# EAGLE design nano_v1.1 (EAGLE 6.3)
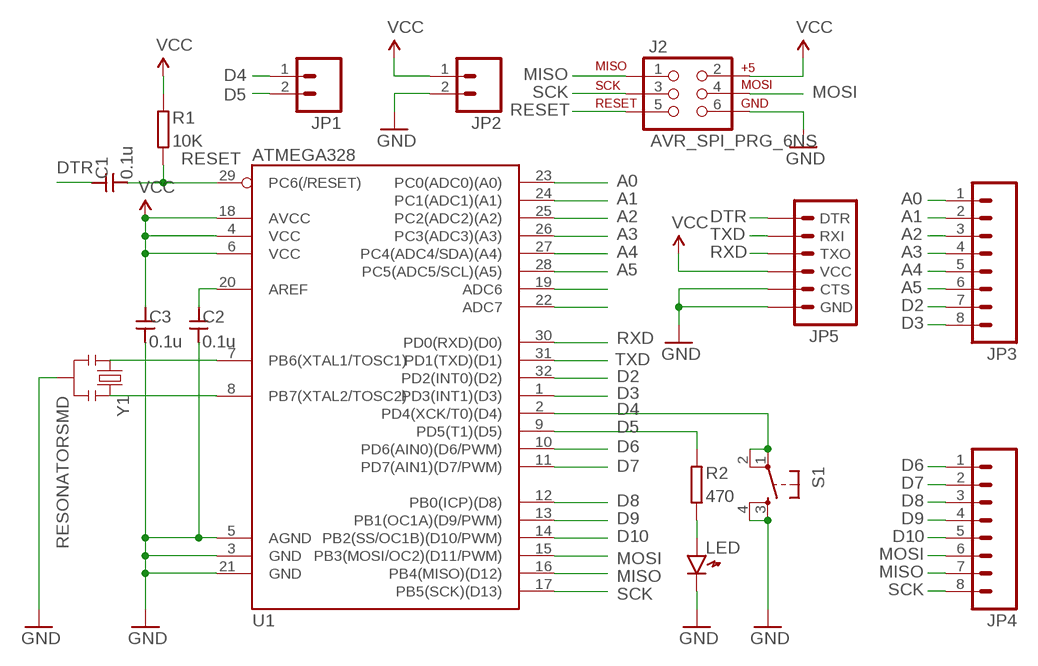
[diagram p0: schematic, sheet 1]

## Parts
C1  0.1u  CAPACITOR1608  [SMD1608]
C2  0.1u  CAPACITOR1608  [SMD1608]
C3  0.1u  CAPACITOR1608  [SMD1608]
J2  AVR_SPI_PRG_6NS  [2X3-NS]
JP1  M02PTH  [1X02]
JP2  M02PTH  [1X02]
JP3  M081X08  [1X08]
JP4  M081X08  [1X08]
JP5  ARDUINO_SERIAL_PROGRAMPTH  [1X06]
LED  LED1608  [LED1608]
R1  10K  REGISTOR1608  [SMD1608]
R2  470  REGISTOR1608  [SMD1608]
S1  TAC_SWITCHSMD  [TACTILE_SWITCH_SMD]
U1  ATMEGA328  [TQFP32-08]
Y1  RESONATORSMD  [RESONATOR-SMD]

## Nets
A0: JP3.1 U1.23(PC0(ADC0)(A0))
A1: JP3.2 U1.24(PC1(ADC1)(A1))
A2: JP3.3 U1.25(PC2(ADC2)(A2))
A3: JP3.4 U1.26(PC3(ADC3)(A3))
A4: JP3.5 U1.27(PC4(ADC4/SDA)(A4))
A5: JP3.6 U1.28(PC5(ADC5/SCL)(A5))
D2: JP3.7 U1.32(PD2(INT0)(D2))
D3: JP3.8 U1.1(PD3(INT1)(D3))
D4: JP1.1 S1.1 S1.2 U1.2(PD4(XCK/T0)(D4))
D5: JP1.2 R2.1 U1.9(PD5(T1)(D5))
D6: JP4.1 U1.10(PD6(AIN0)(D6/PWM))
D7: JP4.2 U1.11(PD7(AIN1)(D7/PWM))
D8: JP4.3 U1.12(PB0(ICP)(D8))
D9: JP4.4 U1.13(PB1(OC1A)(D9/PWM))
D10: JP4.5 U1.14(PB2(SS/OC1B)(D10/PWM))
DTR: C1.1 JP5.1(DTR)
GND: C2.2 C3.2 J2.6 JP2.2 JP5.5(CTS) JP5.6(GND) LED.K S1.3 S1.4 U1.3(GND) U1.5(AGND) U1.21(GND) Y1.2
MISO: J2.1 JP4.7 U1.16(PB4(MISO)(D12))
MOSI: J2.4 JP4.6 U1.15(PB3(MOSI/OC2)(D11/PWM))
N$1: LED.A R2.2
N$10: C2.1 U1.20(AREF)
N$12: U1.8(PB7(XTAL2/TOSC2)) Y1.3
N$13: U1.7(PB6(XTAL1/TOSC1)) Y1.1
N$20: U1.19(ADC6)
N$21: U1.22(ADC7)
RESET: C1.2 J2.5 R1.2 U1.29(PC6(/RESET))
RXD: JP5.3(TXO) U1.30(PD0(RXD)(D0))
SCK: J2.3 JP4.8 U1.17(PB5(SCK)(D13))
TXD: JP5.2(RXI) U1.31(PD1(TXD)(D1))
VCC: C3.1 J2.2 JP2.1 JP5.4(VCC) R1.1 U1.4(VCC) U1.6(VCC) U1.18(AVCC)

## Library data of the parts
C1-C3 = kawaiti:CAPACITOR: Generic Capacitor
J2 = SparkFun-Connectors:AVR_SPI_PRG_6: AVR ISP 6 Pin This is the reduced ISP connector for AVR programming. Common on Arduino. This footprint will take up less PCB space and can be used with a 10-pin to 6-pin adapter such as SKU: BOB-08508
JP1 JP2 = SparkFun-Connectors:M02: Header 2 Standard 2-pin 0.1" header. Use with straight break away headers (SKU : PRT-00116), right angle break away headers (PRT-00553), swiss pins (PRT-00743), machine pins (PRT-00117), and female headers (PRT-00115). Molex polarized connector foot print use with SKU : PRT-08233 with associated crimp pins and housings.
JP3 JP4 = kawaiti:M08: Header 8 Standard 8-pin 0.1" header. Use with straight break away headers (SKU : PRT-00116), right angle break away headers (PRT-00553), swiss pins (PRT-00743), machine pins (PRT-00117), and female headers (PRT-00115).
JP5 = SparkFun-Connectors:ARDUINO_SERIAL_PROGRAM: FTDI connector footprints
LED = kawaiti:LED: Generic LEDs
R1 R2 = kawaiti:REGISTOR: Generic Registor
S1 = SparkFun-Electromechanical:TAC_SWITCH: Momentary Switch Button commonly used for reset or general input. Spark Fun Electronics SKU : COM-00097
U1 = kawaiti:ATMEGA328: ATmega328P-AU TQFP 32 pin
Y1 = SparkFun-FreqCtrl:RESONATOR: Resonator Small SMD resonator. This is the itty bitty 10/20MHz resonators with built in caps. CSTCE10M0G55 and CSTCE20M0V53. Footprint has been reviewed closely but hasn't been tested yet.

## Board
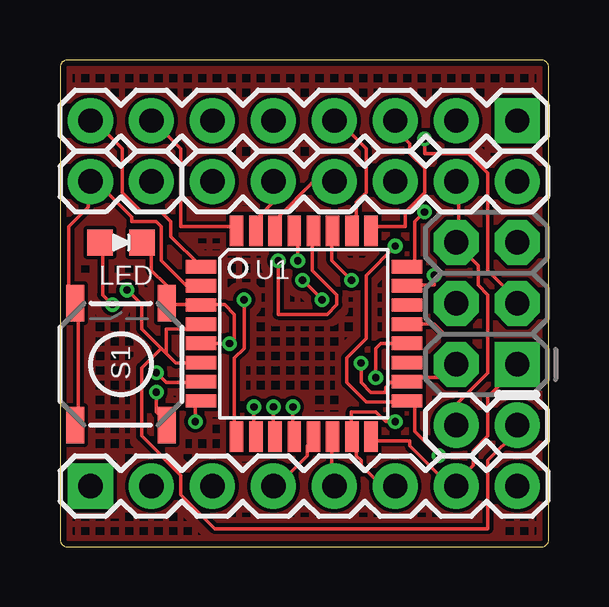
[diagram p1: board, top side]
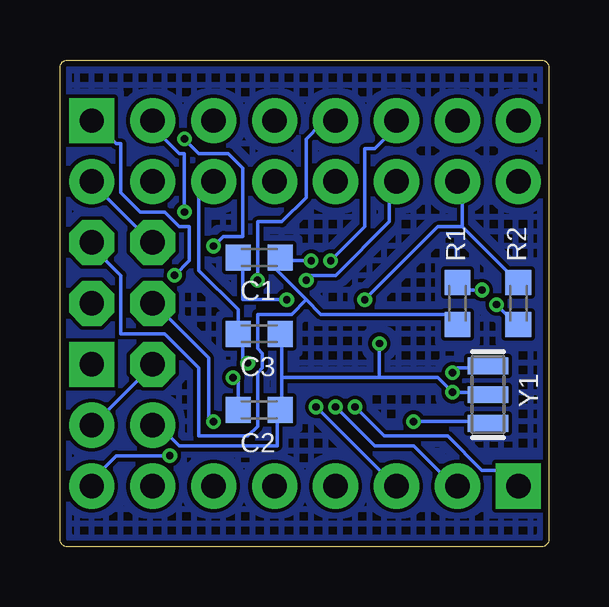
[diagram p2: board, bottom side, seen from below]

Size 20.37 x 20.31 mm. Coordinates in mm from the lower left corner, seen from the top.
Outline: 0,19.99 0,0.32 arc90 0.32,0 20.05,0 arc90 20.37,0.32 20.37,19.99 arc90 20.05,20.31 0.32,20.31 arc90 0,19.99
Copper layers (1*16): Top 0.035mm / dielectric 1.5mm / Bottom 0.035mm
Design rules "Fusion_eagle_rule_v1.1": minimum track width 6mil, minimum drill 12mil, track to track 6mil, track to pad 6mil, pad to pad 6mil, via to via 6mil, smd to smd 0mil, copper to edge 10mil, drill to drill 10mil, minimum pad ring 10mil, minimum via ring 6mil, stop-mask expansion 2mil, vias tented up to drill 100mil, thermal gap 10mil

### Footprints (pad centres in the part's own frame; a part is rotated, then mirrored left to right if it is on the bottom)
SMD1608 = smd 1.05 x 1.08: 1 -0.875,0; 2 0.875,0
2X3-NS = drill 1.016 pad 1.88 square: 1 -2.54,-1.27 | drill 1.016 pad 1.88 octagon: 2 -2.54,1.27; 3 0,-1.27; 4 0,1.27; 5 2.54,-1.27; 6 2.54,1.27
1X02 = drill 1.016 pad 1.88: 1 0,0; 2 2.54,0
1X08 = drill 1.016 pad 1.88 square: 1 0,0 | drill 1.016 pad 1.88: 2 2.54,0; 3 5.08,0; 4 7.62,0; 5 10.16,0; 6 12.7,0; 7 15.24,0; 8 17.78,0
1X06 = drill 1.016 pad 1.88: 1 0,0; 2 2.54,0; 3 5.08,0; 4 7.62,0; 5 10.16,0; 6 12.7,0
LED1608 = smd 1.05 x 1.08: A -0.875,0; K 0.875,0
TACTILE_SWITCH_SMD = smd 1.524 x 0.762: 1 -2.54,1.905; 2 2.54,1.905; 3 -2.54,-1.905; 4 2.54,-1.905
TQFP32-08 = smd 1.27 x 0.559: 1 -4.293,2.8; 2 -4.293,2; 3 -4.293,1.2; 4 -4.293,0.4; 5 -4.293,-0.4; 6 -4.293,-1.2; 7 -4.293,-2; 8 -4.293,-2.8; 17 4.293,-2.8; 18 4.293,-2; 19 4.293,-1.2; 20 4.293,-0.4; 21 4.293,0.4; 22 4.293,1.2; 23 4.293,2; 24 4.293,2.8 | smd 0.559 x 1.27: 9 -2.8,-4.293; 10 -2,-4.293; 11 -1.2,-4.293; 12 -0.4,-4.293; 13 0.4,-4.293; 14 1.2,-4.293; 15 2,-4.293; 16 2.8,-4.293; 25 2.8,4.293; 26 2,4.293; 27 1.2,4.293; 28 0.4,4.293; 29 -0.4,4.293; 30 -1.2,4.293; 31 -2,4.293; 32 -2.8,4.293
RESONATOR-SMD = smd 0.7 x 1.7: 1 -1.2,0; 2 0,0; 3 1.2,0

### Placement (x,y rotation side)
C1  12.07,12.06 0 bottom
C2  12.07,5.71 0 bottom
C3  12.07,8.89 0 bottom
J2  17.78,10.16 90 top
JP1  1.27,15.24 0 top
JP2  19.05,5.08 180 top
JP3  19.05,17.78 180 top
JP4  1.27,2.54 0 top
JP5  6.35,15.24 0 top
LED  2.54,12.7 0 top
R1  3.81,10.16 270 bottom
R2  1.27,10.16 270 bottom
S1  2.54,7.62 90 top
U1  10.16,8.89 0 top
Y1  2.54,6.35 270 bottom

### Tracks (layer width: path | path; a pad name or v marks a point on that pad's centre or on a via)
A0  (via drill 0.3)
  Top 0.152: v15.6,11.33 15.6,10.92 14.58,10.92 U1.23
  Bottom 0.152: v15.6,11.33 14.99,11.94 14.99,13.36 15.39,13.36 16,13.97 17.02,13.97 17.83,14.78 17.83,16.81 18.03,16.81 18.85,17.63 19.05,17.63 JP3.1
A1  (via drill 0.3)
  Top 0.152: v15.19,13.97 14.78,13.56 14.78,11.94 14.58,11.74 U1.24
  Bottom 0.152: v15.19,13.97 15.19,16.41 15.39,16.41 16.61,17.63 JP3.2
A2
  Top 0.152: JP3.3 13.97,17.42 14.58,16.81 14.58,16.41 15.19,15.8 15.19,14.78 14.38,13.97 14.38,13.36 13.16,13.36 U1.25
A3
  Top 0.152: U1.26 12.34,13.36 12.34,14.38 12.75,14.78 12.75,16.61 11.53,17.83 JP3.4
A4  (via drill 0.3)
  Top 0.152: v12.14,11.13 11.33,11.94 11.33,13.16 U1.27
  Bottom 0.152: v12.14,11.13 12.14,13.56 11.12,13.56 10.11,14.58 10.11,17.02 9.5,17.63 8.89,17.63 JP3.5
A5  (via drill 0.3)
  Top 0.152: v9.09,11.94 9.09,9.7 11.12,9.7 11.53,10.11 11.53,10.52 10.52,11.53 10.52,13.16 U1.28
  Bottom 0.152: v9.09,11.94 7.67,13.36 7.67,16.61 7.26,16.61 6.25,17.63 JP3.6
D2
  Top 0.152: U1.32 7.26,13.36 5.03,13.36 5.03,16.61 3.81,17.83 JP3.7
D3
  Top 0.152: U1.1 5.84,11.74 4.62,12.95 4.62,13.56 4.22,13.97 3.4,13.97 2.59,14.78 2.59,16.61 1.37,17.83 JP3.8
D4
  Top 0.152: S1.1 0.76,5.23 0.76,10.11 S1.2 0.56,10.31 0.36,10.52 0.36,13.36 1.17,14.17 1.17,15.19 JP1.1 1.37,15.39 3,13.77 3,13.56 4.01,13.56 4.22,13.36 4.22,11.94 5.23,10.92 5.84,10.92 U1.2
D5  (via drill 0.3)
  Top 0.152: v7.67,10.31 7.67,8.28 7.26,7.87 7.26,4.62 U1.9
  Bottom 0.152: 3.61,13.36 1.37,11.13 R2.1 | 3.61,13.36 3.61,15.19 3.81,15.19 JP1.2 | v7.67,10.31 4.62,13.36 3.61,13.36
D6  (via drill 0.3)
  Top 0.152: v8.08,5.84 8.08,4.62 U1.10
  Bottom 0.152: v8.08,5.84 6.86,4.62 4.22,4.62 2.79,3.2 1.98,3.2 1.37,2.59 JP4.1
D7  (via drill 0.3)
  Top 0.152: v8.89,5.84 8.89,4.62 U1.11
  Bottom 0.152: v8.89,5.84 7.26,4.22 5.64,4.22 4.01,2.59 3.81,2.59 JP4.2
D8  (via drill 0.3)
  Top 0.152: v9.7,5.84 9.7,4.62 U1.12
  Bottom 0.152: v9.7,5.84 6.45,2.59 JP4.3
D9
  Top 0.152: U1.13 10.52,4.42 10.31,4.22 10.31,3.81 8.89,2.39 JP4.4
D10
  Top 0.152: U1.14 11.33,4.42 11.33,2.59 JP4.5
DTR  (via drill 0.3)
  Top 0.152: v10.11,11.13 v10.92,10.31
  Bottom 0.152: v10.92,10.31 12.75,10.31 12.75,11.94 C1.1 | v10.11,11.13 9.91,11.33 8.89,11.33 6.66,13.56 6.66,15.19 6.45,15.19 JP5.1
GND  (via drill 0.3)
  Top 0.152: JP5.5 16.61,15.19 16.61,12.75 J2.6 16.61,12.55 17.42,11.74 17.42,10.92 17.83,10.52 17.83,8.89 | U1.5 6.05,8.48 v7.06,8.48 7.26,8.48 7.26,9.7 6.86,10.11 6.05,10.11 U1.3 5.84,10.11 4.62,10.11 S1.4 4.42,10.31 4.42,10.92 3.81,11.53 3.81,12.34 3.61,12.55 LED.K | v4.01,6.45 4.01,5.64 4.42,5.23 S1.3 | 17.83,8.89 16,8.89 15.6,9.3 14.58,9.3 U1.21 | 17.83,8.89 17.83,7.26 16.61,6.04 16.61,5.23 JP2.2
  Bottom 0.152: JP5.6 19.05,15.19 16.61,12.75 J2.6 | Y1.2 2.59,6.45 v4.01,6.45 4.62,7.06 7.06,7.06 | 11.12,7.06 11.12,8.89 C3.2 | 11.12,7.06 11.12,5.84 C2.2 11.33,5.64 11.33,4.22 15.39,4.22 16.21,5.03 16.41,5.03 JP2.2 | 11.12,7.06 7.06,7.06 | 7.06,7.06 v7.06,8.48
MISO
  Top 0.152: U1.16 13.16,4.42 14.58,4.42 14.58,4.22 16.41,2.39 JP4.7 16.61,2.59 16.61,2.79 17.22,3.4 17.22,4.01 17.83,4.62 17.83,6.25 19.05,7.47 J2.1
MOSI  (via drill 0.3)
  Top 0.152: JP4.6 13.97,2.59 13.36,2.59 12.55,3.4 12.55,3.61 12.34,3.81 12.34,4.42 U1.15 12.14,4.62 12.14,5.64 13.16,5.64 13.56,5.23 v13.97,5.23
  Bottom 0.152: v13.97,5.23 14.17,5.23 14.17,7.87 16.41,10.11 J2.4
N$1  (via drill 0.3)
  Top 0.152: v2.18,10.11 1.78,10.52 1.78,12.55 LED.A
  Bottom 0.152: v2.18,10.11 1.37,9.3 R2.2
N$2
  pour Bottom (hatched): 0,20.32 20.32,20.32 20.32,0 0,0
N$3
  pour Top (hatched): 0,20.32 20.32,20.32 20.32,0 0,0
N$10  (via drill 0.3)
  Top 0.152: v13.16,7.06 13.16,8.28 13.36,8.48 14.38,8.48 U1.20
  Bottom 0.152: v13.16,7.06 12.95,7.06 12.95,5.84 C2.1
N$12  (via drill 0.3)
  Top 0.152: v5.64,5.23 5.64,5.84 5.84,6.04 U1.8
  Bottom 0.152: v5.64,5.23 2.59,5.23 Y1.3
N$13  (via drill 0.3)
  Top 0.152: v4.01,7.26 4.42,6.86 5.84,6.86 U1.7
  Bottom 0.152: v4.01,7.26 3.81,7.47 2.59,7.47 Y1.1
RESET  (via drill 0.3)
  Top 0.152: v9.91,11.94 9.91,13.16 U1.29
  Bottom 0.152: 10.11,10.31 11.33,11.53 11.33,11.94 C1.2 11.12,11.94 v9.91,11.94 | 10.11,10.31 9.5,9.7 4.22,9.7 R1.2 | 10.11,10.31 10.72,9.7 12.14,9.7 12.14,8.28 11.94,8.08 11.94,7.47 12.14,7.26 12.14,5.03 12.55,4.62 14.58,4.62 14.58,7.47 16,8.89 17.83,8.89 17.83,11.33 19.05,12.55 J2.5
RXD
  Top 0.152: U1.30 9.09,13.36 9.09,13.77 10.52,15.19 11.33,15.19 JP5.3
SCK  (via drill 0.3)
  Top 0.152: v15.8,3.81 14.78,4.83 14.78,5.84 14.58,6.04 U1.17 14.38,6.04 12.75,6.04 11.94,6.86 11.94,7.87 12.75,8.69 12.75,11.33 v13.97,12.55 | v15.19,17.02 15.19,16.41 17.02,16.41 17.83,15.6 17.83,11.53 19.05,10.31 J2.3
  Bottom 0.152: v15.8,3.81 18.03,3.81 19.05,2.79 JP4.8 | v15.19,17.02 14.58,16.41 13.36,16.41 12.75,15.8 12.75,12.95 13.56,12.95 v13.97,12.55
TXD
  Top 0.152: JP5.2 8.89,14.38 8.28,13.77 8.28,13.36 U1.31
VCC  (via drill 0.3)
  Top 0.152: J2.2 16.41,7.47 16.41,7.06 14.58,7.06 U1.18 14.38,6.86 13.77,6.86 13.56,6.66 13.56,6.45 12.95,6.45 12.55,6.86 v12.55,7.67 | v2.79,10.72 3.4,10.11 3.4,9.09 4.22,8.28 | 4.42,8.08 4.83,7.67 5.84,7.67 U1.6 | 4.42,8.08 4.22,8.28 | 4.42,8.08 4.42,9.09 5.84,9.09 U1.4 | 4.22,8.28 3.4,7.47 3.4,4.62 5.03,3 5.03,2.18 6.45,0.76 17.83,0.76 17.83,3.61 19.05,4.83 JP2.1
  Bottom 0.152: JP5.4 13.97,15.19 14.58,15.19 14.58,11.53 12.95,9.91 12.95,8.89 C3.1 12.75,8.89 12.75,7.67 v12.55,7.67 | v2.79,10.72 3.61,10.72 3.81,10.92 R1.1 | J2.2 16.61,7.47 18.85,5.23 19.05,5.23 JP2.1